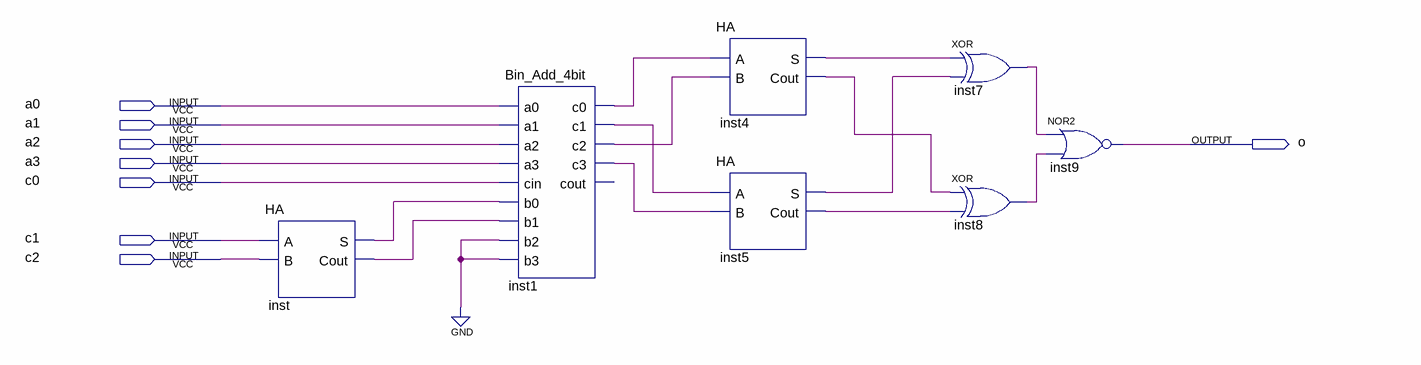
[diagram p0: schematic sheet]
// Quartus schematic ISDIV3.bdf as structural Verilog: 7 symbols, 8 pins
module ISDIV3 (
  input  a0,
  input  a1,
  input  a2,
  input  a3,
  input  c0,
  input  c1,
  input  c2,
  output o
);

  wire inst1_c0, inst1_c1, inst1_c2, inst1_c3, inst4_cout, inst4_s, inst5_cout, inst5_s, inst7_out,
       inst8_out, inst_cout, inst_s;

  HA inst (.A(c1), .B(c2), .S(inst_s), .Cout(inst_cout));
  Bin_Add_4bit inst1 (
    .a0(a0), .a1(a1), .a2(a2), .a3(a3), .cin(c0), .b0(inst_s), .b1(inst_cout), .b2(1'b0), .b3(1'b0),
    .c0(inst1_c0), .c1(inst1_c1), .c2(inst1_c2), .c3(inst1_c3));  // open: cout
  HA inst4 (.A(inst1_c0), .B(inst1_c2), .S(inst4_s), .Cout(inst4_cout));
  HA inst5 (.A(inst1_c1), .B(inst1_c3), .S(inst5_s), .Cout(inst5_cout));
  xor inst7 (inst7_out, inst4_s, inst5_s);
  xor inst8 (inst8_out, inst4_cout, inst5_cout);
  nor inst9 (o, inst7_out, inst8_out);
endmodule
